# EAGLE schematic circuit (EAGLE 9.6.2)
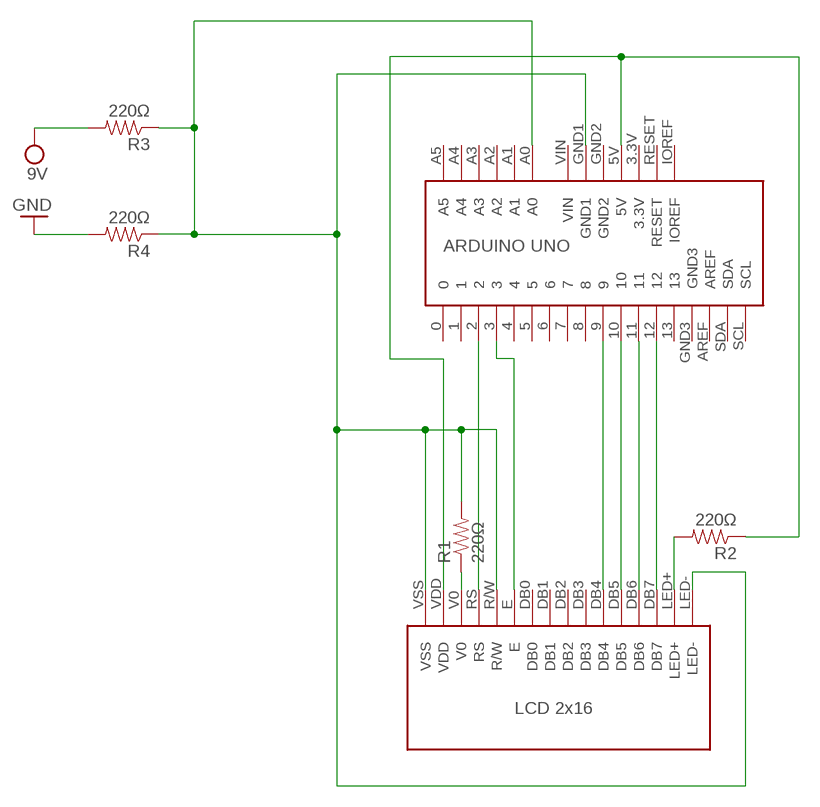
[diagram p0: schematic, sheet 1]

## Parts
R1  220Ω  RESISTOR0402  [0402-RES]
R2  220Ω  RESISTOR0402  [0402-RES]
R3  220Ω  RESISTOR0402  [0402-RES]
R4  220Ω  RESISTOR0402  [0402-RES]
U$1  LCD_2_16  [LCD_2_16]
U$2  ARDUINO_UNO  [ARDUINO_UNO]

## Nets
GND: R4.2
N$1: U$1.DB4 U$2.9
N$2: U$1.DB5 U$2.10
N$3: U$1.DB6 U$2.11
N$4: U$1.DB7 U$2.12
N$5: R1.1 U$1.V0
N$6: R2.1 U$1.VDD U$2.5V
N$7: U$1.RS U$2.2
N$8: U$1.E U$2.3
N$9: R2.2 U$1.LED+
N$13: R1.2 R3.1 R4.1 U$1.LED- U$1.R/W U$1.VSS U$2.A0 U$2.GND1
VCC: R3.2 ; supply symbol labelled 9V
Unconnected: U$1.DB0 U$1.DB1 U$1.DB2 U$1.DB3 U$2.0 U$2.1 U$2.3.3V U$2.4 U$2.5 U$2.6 U$2.7 U$2.8 U$2.13 U$2.A1 U$2.A2 U$2.A3 U$2.A4 U$2.A5 U$2.AREF U$2.GND2 U$2.GND3 U$2.IOREF U$2.RESET U$2.SCL U$2.SDA U$2.VIN

## Library data of the parts
R1-R4 = SparkFun-Resistors:RESISTOR: Resistor Basic schematic elements and footprints for 0603, 1206, and PTH resistors.
U$1 = CircuitLibrary:LCD_2_16
U$2 = CircuitLibrary:ARDUINO_UNO